# EAGLE design test board_2 (EAGLE 6.5.0)
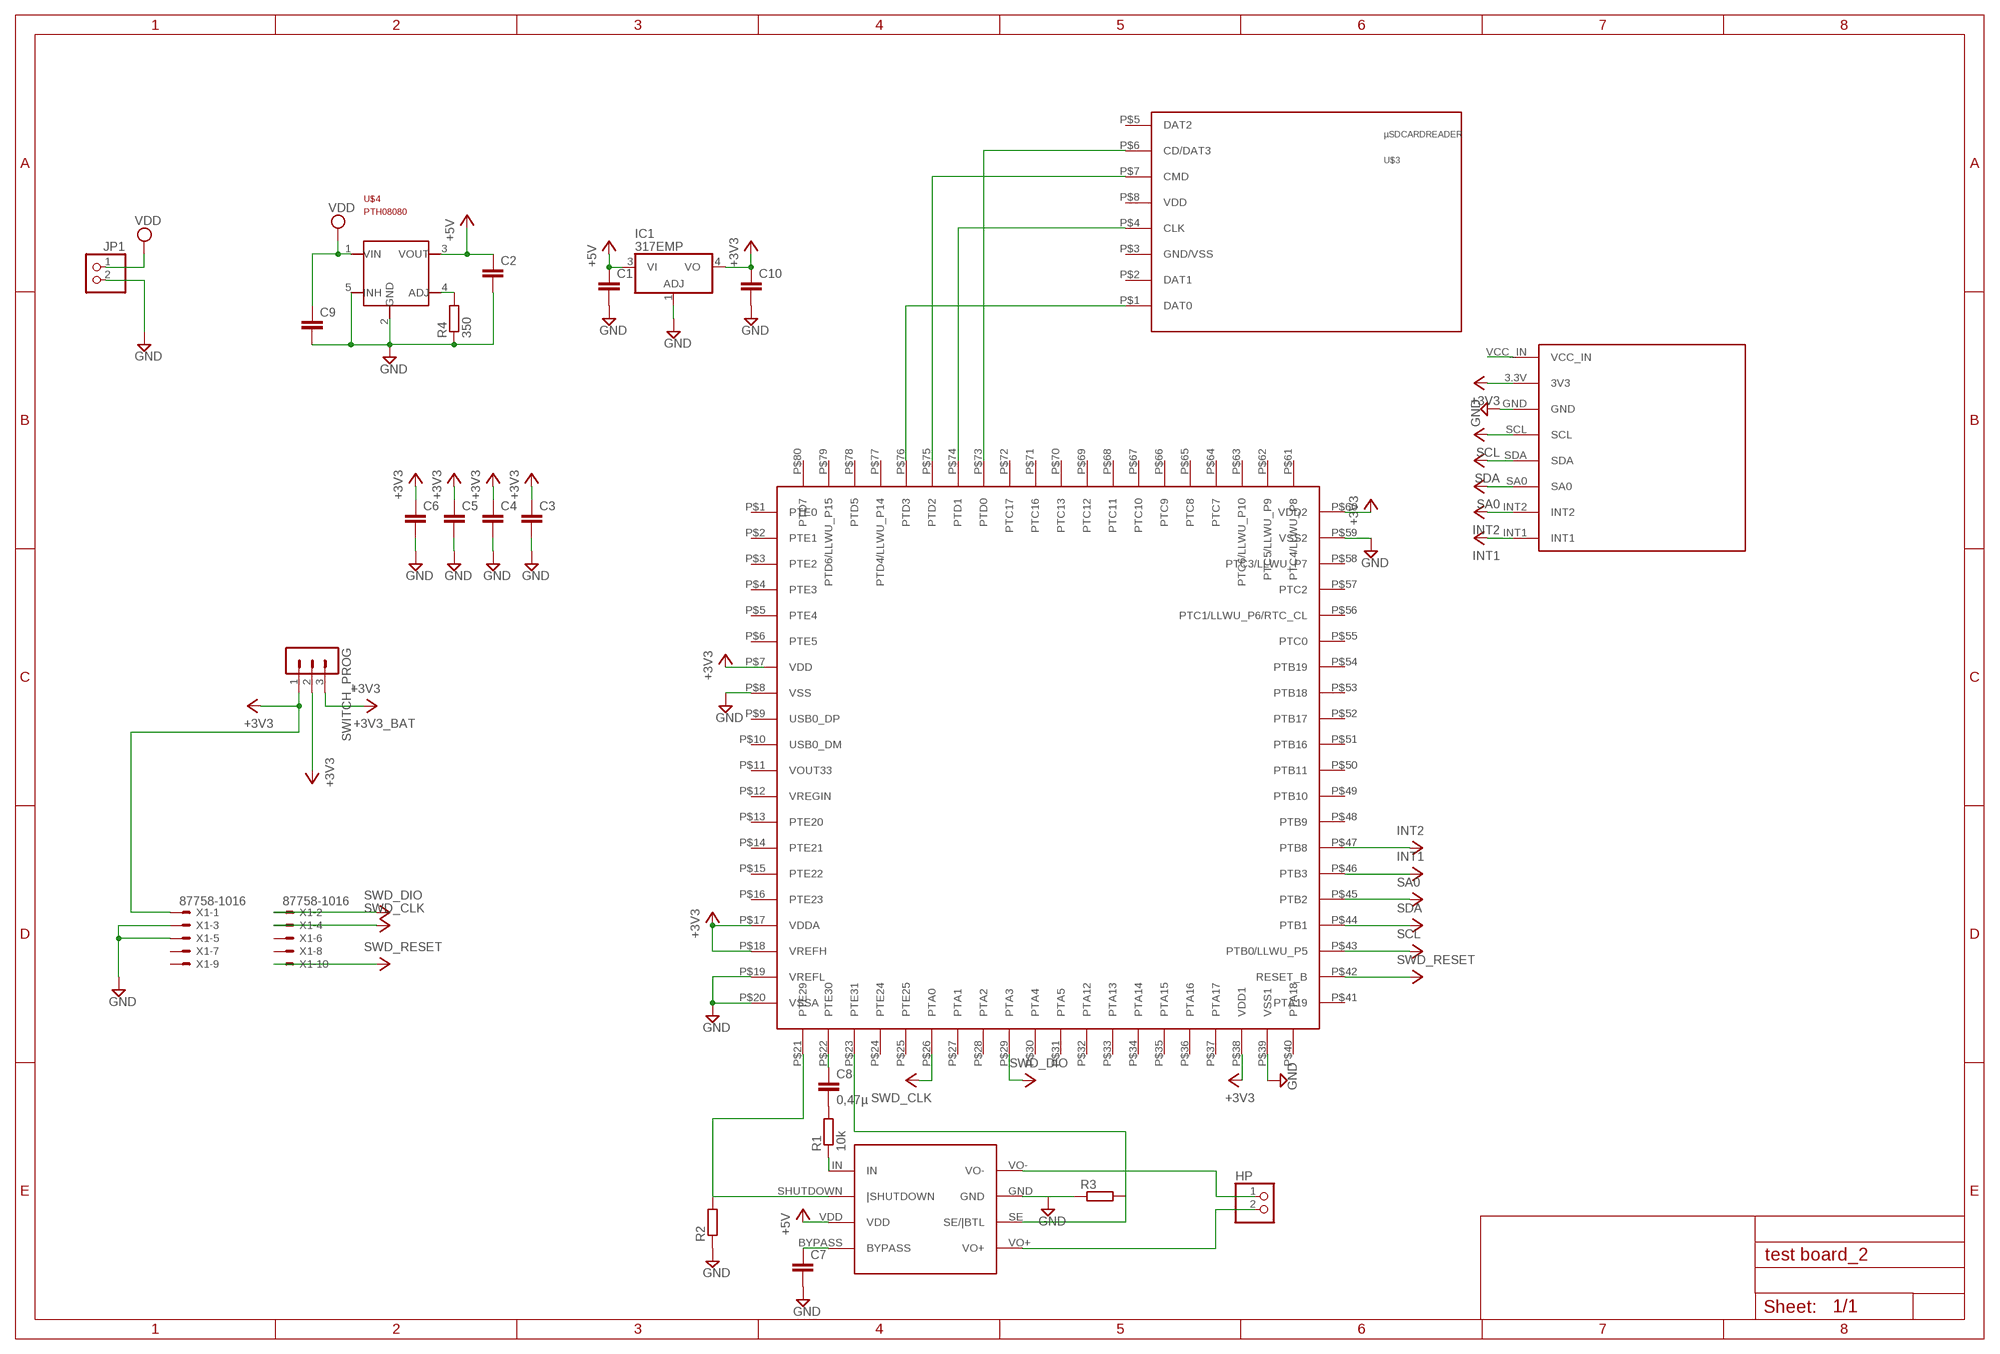
[diagram p0: schematic, sheet 1]

## Parts
C1  C-EUC1206K  [C1206K]
C2  C-EUC1206K  [C1206K]
C3  C-EUC1206K  [C1206K]
C4  C-EUC1206K  [C1206K]
C5  C-EUC1206K  [C1206K]
C6  C-EUC1206K  [C1206K]
C7  C-EU025-025X050  [C025-025X050]
C8  0,47µ  C-EUC1206K  [C1206K]
C9  C-EUC1206K  [C1206K]
C10  C-EUC1206K  [C1206K]
HP  PINHD-1X2  [1X02]
IC1  317EMP  [SOT223]
JP1  PINHD-1X2  [1X02]
R1  10k  R-EU_R0805  [R0805]
R2  R-EU_R0805  [R0805]
R3  R-EU_R0805  [R0805]
R4  350  R-EU_R0805  [R0805]
SWITCH_PROG  MA03-1  [MA03-1]
U$1  TPA0211  [TPA0211]
U$2  KL25Z_LQFP80  [KL25Z_LQFP80]
U$3  µSDCARDREADER  [MICROSD]
U$4  PTH08080  [PTH08080EUF]
U$5  DEV  [MMA8451]
X1  87758-1016  [87758-1016]

## Nets
+3V3: C3.1 C4.1 C5.1 C6.1 SWITCH_PROG.2 U$2.P$17(VDDA) U$2.P$18(VREFH) U$2.P$38(VDD1) U$2.P$60(VDD2) U$5.3.3V(3V3)
+3V3_BAT: C10.1 IC1.4(VO) SWITCH_PROG.3 ; supply symbol labelled +3V3
+3V3_SWD: SWITCH_PROG.1 X1.1 ; supply symbol labelled +3V3
+5V: C1.1 C2.1 IC1.3(VI) U$1.VDD U$4.3(VOUT)
GND [power]: C1.2 C2.2 C3.2 C4.2 C5.2 C6.2 C7.2 C9.2 C10.2 IC1.1(ADJ) JP1.2 R2.1 R3.1 R4.1 U$1.GND U$2.P$8(VSS) U$2.P$19(VREFL) U$2.P$20(VSSA) U$2.P$39(VSS1) U$2.P$59(VSS2) U$4.2(GND) U$4.5(INH) U$5.GND X1.3 X1.5
INT1: U$2.P$46(PTB3) U$5.INT1
INT2: U$2.P$47(PTB8) U$5.INT2
N$1: U$2.P$76(PTD3) U$3.P$1(DAT0)
N$2: U$2.P$73(PTD0) U$3.P$6(CD/DAT3)
N$3: U$2.P$75(PTD2) U$3.P$7(CMD)
N$4: U$2.P$74(PTD1) U$3.P$4(CLK)
N$5: C8.2 R1.2
N$6: C7.1 U$1.BYPASS
N$7: HP.1 U$1.VO-
N$9: U$5.VCC_IN
N$10: R1.1 U$1.IN
N$11: C8.1 U$2.P$22(PTE30)
N$12: R2.2 U$1.SHUTDOWN(|SHUTDOWN) U$2.P$21(PTE29)
N$14: R3.2 U$1.SE(SE/|BTL) U$2.P$23(PTE31)
N$18: R4.2 U$4.4(ADJ)
SA0: U$2.P$45(PTB2) U$5.SA0
SCL: U$2.P$43(PTB0/LLWU_P5) U$5.SCL
SDA: U$2.P$44(PTB1) U$5.SDA
SWD_CLK: U$2.P$26(PTA0) X1.4
SWD_DIO: U$2.P$29(PTA3) X1.2
SWD_RESET: U$2.P$42(RESET_B) X1.10
VDD: C9.1 JP1.1 U$4.1(VIN)
VO+: HP.2 U$1.VO+
Unconnected: U$2.P$1(PTE0) U$2.P$2(PTE1) U$2.P$3(PTE2) U$2.P$4(PTE3) U$2.P$5(PTE4) U$2.P$6(PTE5) U$2.P$7(VDD) U$2.P$9(USB0_DP) U$2.P$10(USB0_DM) U$2.P$11(VOUT33) U$2.P$12(VREGIN) U$2.P$13(PTE20) U$2.P$14(PTE21) U$2.P$15(PTE22) U$2.P$16(PTE23) U$2.P$24(PTE24) U$2.P$25(PTE25) U$2.P$27(PTA1) U$2.P$28(PTA2) U$2.P$30(PTA4) U$2.P$31(PTA5) U$2.P$32(PTA12) U$2.P$33(PTA13) U$2.P$34(PTA14) U$2.P$35(PTA15) U$2.P$36(PTA16) U$2.P$37(PTA17) U$2.P$40(PTA18) U$2.P$41(PTA19) U$2.P$48(PTB9) U$2.P$49(PTB10) U$2.P$50(PTB11) U$2.P$51(PTB16) U$2.P$52(PTB17) U$2.P$53(PTB18) U$2.P$54(PTB19) U$2.P$55(PTC0) U$2.P$56(PTC1/LLWU_P6/RTC_CL) U$2.P$57(PTC2) U$2.P$58(PTC3/LLWU_P7) U$2.P$61(PTC4/LLWU_P8) U$2.P$62(PTC5/LLWU_P9) U$2.P$63(PTC6/LLWU_P10) U$2.P$64(PTC7) U$2.P$65(PTC8) U$2.P$66(PTC9) U$2.P$67(PTC10) U$2.P$68(PTC11) U$2.P$69(PTC12) U$2.P$70(PTC13) U$2.P$71(PTC16) U$2.P$72(PTC17) U$2.P$77(PTD4/LLWU_P14) U$2.P$78(PTD5) U$2.P$79(PTD6/LLWU_P15) U$2.P$80(PTD7) U$3.P$2(DAT1) U$3.P$3(GND/VSS) U$3.P$5(DAT2) U$3.P$8(VDD) X1.6 X1.7 X1.8 X1.9

## Library data of the parts
C1-C10 = rcl:C-EU: CAPACITOR, European symbol
HP JP1 = pinhead:PINHD-1X2: PIN HEADER
IC1 = linear:*317: Positive VOLTAGE REGULATOR
R1-R4 = rcl:R-EU_: RESISTOR, European symbol
SWITCH_PROG = con-lstb:MA03-1: PIN HEADER; OC_FARNELL: unknown; OC_NEWARK: unknown
U$1 = TPA0211:TPA0211
U$2 = KL25Z_LQFP80:KL25Z_LQFP80: Freescale MCU 48MHz LQFP80
U$3 = Microsd:µSDCARDREADER
U$4 = PTH08080:PTH08080: DC-DC, Vin 5..18V, Vout 2..6V, 2A www.ti.com
U$5 = MMA8451_miniboard:DEV
X1 = con-molex:87758-1016: 10 Pin - 2mm Dual Row Single Wafer, Vertical T/H HDR Source: http://www.molex.com/pdm_docs/sd/877580616_sd.pdf; MF: MOLEX; MPN: 87758-1016; OC_FARNELL: 7472340; OC_NEWARK: 59J1558

## Net classes
1 power: width 0.508 mm

## Board
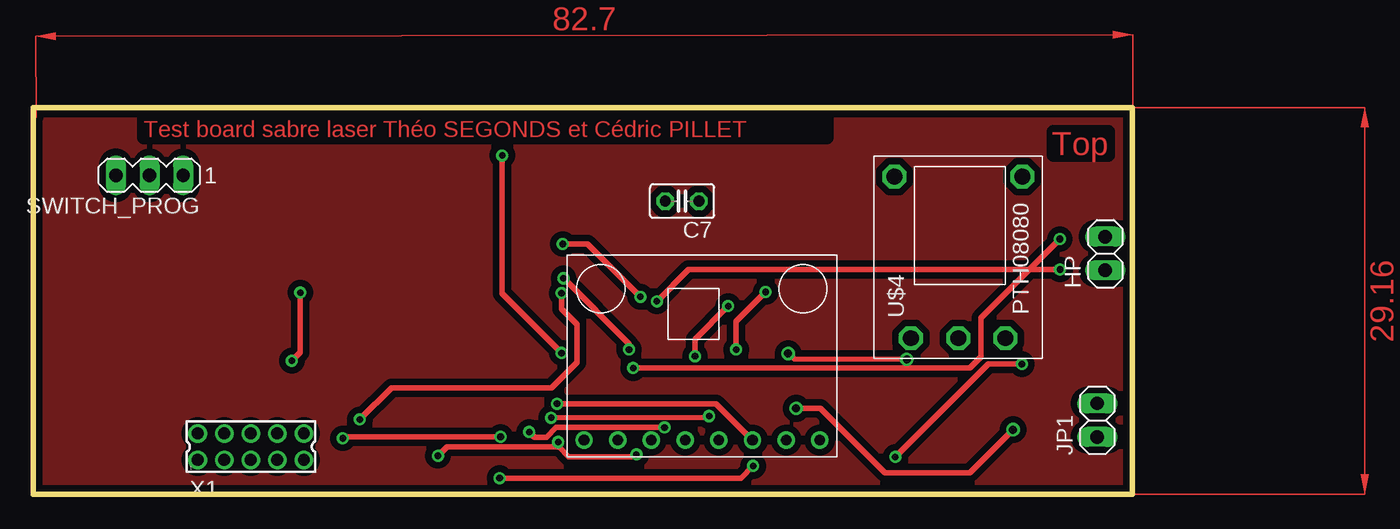
[diagram p1: board, top side]
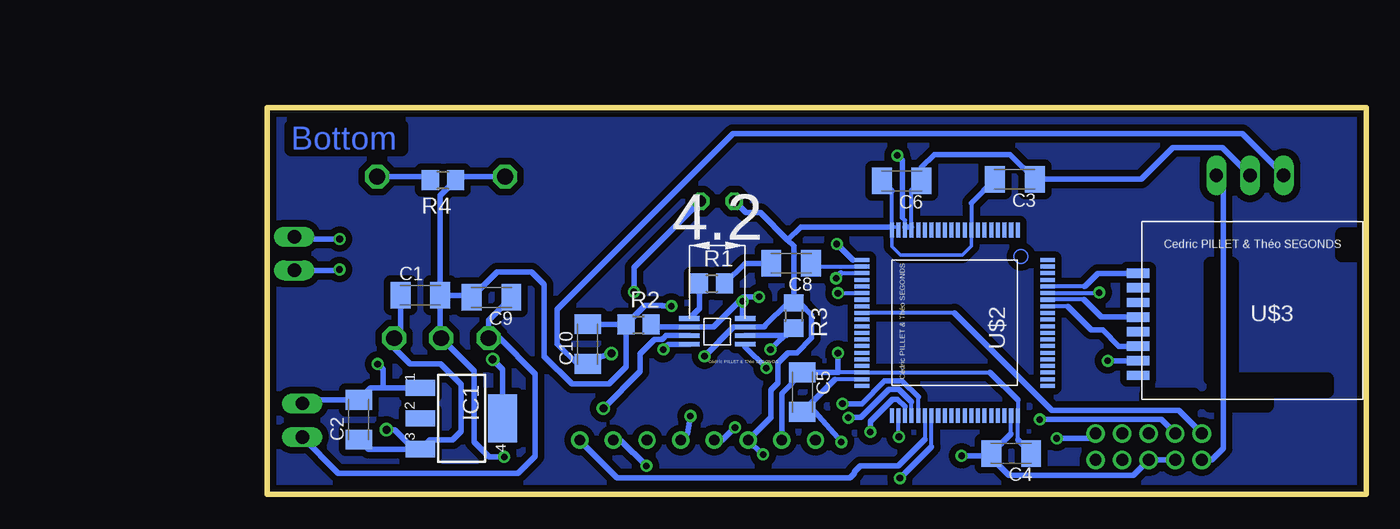
[diagram p2: board, bottom side, seen from below]

Size 82.86 x 29.16 mm. Coordinates in mm from the lower left corner, seen from the top.
Outline: 0,0 82.86,0 82.86,29.16 0,29.16 0,0
Copper layers (1*16): Top 0.1mm / dielectric 1.5mm / Bottom 0.1mm
Design rules "ensea *": minimum track width 0.5mm, minimum drill 0.5mm, track to track 0.5mm, track to pad 0.05mm, pad to pad 0.05mm, via to via 0.5mm, smd to smd 8mil, copper to edge 0.5mm, drill to drill 8mil, minimum pad ring 10mil, minimum via ring 8mil, stop-mask expansion 4mil, vias tented up to drill 0mil, thermal gap 10mil
tRestrict: area 38.5,36 to 50.4,47.8; area 63.4,35.4 to 66.1,38.5; area 15.5,49.1 to 19.4,50.8; area 15.4,59.9 to 19.4,61.4; area 0.6,45.7 to 3,64.7
bRestrict: area 56.5,45.8 to 57.8,48.2; area 46,55.1 to 48.6,57.8

### Footprints (pad centres in the part's own frame; a part is rotated, then mirrored left to right if it is on the bottom)
C1206K = smd 1.5 x 2: 1 -1.5,0; 2 1.5,0
C025-025X050 = drill 0.813 octagon: 1 -1.27,0; 2 1.27,0
1X02 = drill 1.016 long: 1 -1.27,0; 2 1.27,0
SOT223 = smd 1.219 x 2.235: 1 -2.311,-3.099; 2 0,-3.099; 3 2.311,-3.099 | smd 3.6 x 2.2: 4 0,3.099
R0805 = smd 1.3 x 1.5: 1 -0.95,0; 2 0.95,0
MA03-1 = drill 1.016 long: 1 -2.54,0; 2 0,0; 3 2.54,0
TPA0211 = smd 1.55 x 0.35: BYPASS -2.1,-1.15; GND 2.1,0.15; IN -2.1,0.8; SE 2.1,-0.5; SHUTDOWN -2.1,0.15; VDD -2.1,-0.5; VO+ 2.1,-1.15; VO- 2.1,0.8
KL25Z_LQFP80 = smd 0.61 x 0.305: P$1 -7.25,3.75; P$2 -7.25,3.25; P$3 -7.25,2.75; P$4 -7.25,2.25; P$5 -7.25,1.75; P$6 -7.25,1.25; P$7 -7.25,0.75; P$8 -7.25,0.25; P$9 -7.25,-0.25; P$10 -7.25,-0.75; P$11 -7.25,-1.25; P$12 -7.25,-1.75; P$13 -7.25,-2.25; P$14 -7.25,-2.75; P$15 -7.25,-3.25; P$16 -7.25,-3.75; P$17 -7.25,-4.25; P$18 -7.25,-4.75; P$19 -7.25,-5.25; P$20 -7.25,-5.75; P$41 7.25,-5.75; P$42 7.25,-5.25; P$43 7.25,-4.75; P$44 7.25,-4.25; P$45 7.25,-3.75; P$46 7.25,-3.25; P$47 7.25,-2.75; P$48 7.25,-2.25; P$49 7.25,-1.75; P$50 7.25,-1.25; P$51 7.25,-0.75; P$52 7.25,-0.25; P$53 7.25,0.25; P$54 7.25,0.75; P$55 7.25,1.25; P$56 7.25,1.75; P$57 7.25,2.25; P$58 7.25,2.75; P$59 7.25,3.25; P$60 7.25,3.75; P$121 6.75,3.75; P$122 6.75,3.25; P$123 6.75,2.75; P$124 6.75,2.25; P$125 6.75,1.75; P$126 6.75,1.25; P$127 6.75,0.75; P$128 6.75,0.25; P$129 6.75,-0.25; P$130 6.75,-0.75; P$131 6.75,-1.25; P$132 6.75,-1.75; P$133 6.75,-2.25; P$134 6.75,-2.75; P$135 6.75,-3.25; P$136 6.75,-3.75; P$137 6.75,-4.25; P$138 6.75,-4.75; P$139 6.75,-5.25; P$140 6.75,-5.75; P$141 -6.75,3.75; P$142 -6.75,3.25; P$143 -6.75,2.75; P$144 -6.75,2.25; P$145 -6.75,1.75; P$146 -6.75,1.25; P$147 -6.75,0.75; P$148 -6.75,0.25; P$149 -6.75,-0.25; P$150 -6.75,-0.75; P$151 -6.75,-1.25; P$152 -6.75,-1.75; P$153 -6.75,-2.25; P$154 -6.75,-2.75; P$155 -6.75,-3.25; P$156 -6.75,-3.75; P$157 -6.75,-4.25; P$158 -6.75,-4.75; P$159 -6.75,-5.25; P$160 -6.75,-5.75 | smd 0.305 x 0.61: P$21 -4.75,-8.25; P$22 -4.25,-8.25; P$23 -3.75,-8.25; P$24 -3.25,-8.25; P$25 -2.75,-8.25; P$26 -2.25,-8.25; P$27 -1.75,-8.25; P$28 -1.25,-8.25; P$29 -0.75,-8.25; P$30 -0.25,-8.25; P$31 0.25,-8.25; P$32 0.75,-8.25; P$33 1.25,-8.25; P$34 1.75,-8.25; P$35 2.25,-8.25; P$36 2.75,-8.25; P$37 3.25,-8.25; P$38 3.75,-8.25; P$39 4.25,-8.25; P$40 4.75,-8.25; P$61 4.75,6.25; P$62 4.25,6.25; P$63 3.75,6.25; P$64 3.25,6.25; P$65 2.75,6.25; P$66 2.25,6.25; P$67 1.75,6.25; P$68 1.25,6.25; P$69 0.75,6.25; P$70 0.25,6.25; P$71 -0.25,6.25; P$72 -0.75,6.25; P$73 -1.25,6.25; P$74 -1.75,6.25; P$75 -2.25,6.25; P$76 -2.75,6.25; P$77 -3.25,6.25; P$78 -3.75,6.25; P$79 -4.25,6.25; P$80 -4.75,6.25; P$81 -4.75,5.75; P$82 -4.25,5.75; P$83 -3.75,5.75; P$84 -3.25,5.75; P$85 -2.75,5.75; P$86 -2.25,5.75; P$87 -1.75,5.75; P$88 -1.25,5.75; P$89 -0.75,5.75; P$90 -0.25,5.75; P$91 0.25,5.75; P$92 0.75,5.75; P$93 1.25,5.75; P$94 1.75,5.75; P$95 2.25,5.75; P$96 2.75,5.75; P$97 3.25,5.75; P$98 3.75,5.75; P$99 4.25,5.75; P$100 4.75,5.75; P$101 -4.75,-7.75; P$102 -4.25,-7.75; P$103 -3.75,-7.75; P$104 -3.25,-7.75; P$105 -2.75,-7.75; P$106 -2.25,-7.75; P$107 -1.75,-7.75; P$108 -1.25,-7.75; P$109 -0.75,-7.75; P$110 -0.25,-7.75; P$111 0.25,-7.75; P$112 0.75,-7.75; P$113 1.25,-7.75; P$114 1.75,-7.75; P$115 2.25,-7.75; P$116 2.75,-7.75; P$117 3.25,-7.75; P$118 3.75,-7.75; P$119 4.25,-7.75; P$120 4.75,-7.75
MICROSD = smd 1.722 x 0.711: P$1 -0.4,0.4; P$2 -0.4,-0.7; P$3 -0.4,-1.8; P$4 -0.4,-2.9; P$5 -0.4,-4; P$6 -0.4,-5.1; P$7 -0.4,-6.2; P$8 -0.4,-7.3
PTH08080EUF = drill 1.2 octagon: 1 0,0; 2 0,-3.556; 3 0,-7.112; 4 12.192,-8.382; 5 12.192,1.27
MMA8451 = drill 0.8: 3.3V -7.62,6.35; GND -7.62,3.81; INT1 -7.62,-8.89; INT2 -7.62,-6.35; SA0 -7.62,-3.81; SCL -7.62,1.27; SDA -7.62,-1.27; VCC_IN -7.62,8.89
87758-1016 = drill 0.9 pad 1.27: 1 -4,-1; 2 -4,1; 3 -2,-1; 4 -2,1; 5 0,-1; 6 0,1; 7 2,-1; 8 2,1; 9 4,-1; 10 4,1

### Placement (x,y rotation side)
C1  71.32,15 0 bottom
C2  75.96,5.61 90 bottom
C3  26.5,23.74 180 bottom
C4  26.77,3.07 180 bottom
C5  42.52,7.69 270 bottom
C6  35.03,23.62 180 bottom
C7  48.92,22.1 180 top
C8  43.37,17.41 180 bottom
C9  65.96,14.84 180 bottom
C10  58.7,11.31 90 bottom
HP  80.83,18.14 90 top
IC1  68.21,5.7 270 bottom
JP1  80.23,5.57 90 top
R1  49.34,15.88 0 bottom
R2  54.87,12.78 0 bottom
R3  43.17,13.46 270 bottom
R4  69.62,23.67 180 bottom
SWITCH_PROG  8.77,24.05 180 top
U$1  48.93,12.45 0 bottom
U$2  30.03,12.91 270 bottom
U$3  16.81,16.25 0 bottom
U$4  66.19,11.76 90 top
U$5  50.42,11.68 90 top
X1  16.41,3.57 0 top

### Tracks (layer width: path | path; a pad name or v marks a point on that pad's centre or on a via)
+3V3  (via drill 0.5)
  Top 0.406: v35.36,25.54 35.36,15.12 v39.84,10.64
  Bottom 0.305: 39.8,9.16 U$2.P$38 28.38,9.16 | U$2.P$17 34.28,22.87 | 26.28,7.1 U$2.P$60 26.28,4.08 | U$2.P$18 34.78,20.64 34.98,20.84
  Bottom 0.406: 42.52,9.16 39.8,9.16 39.84,9.2 v39.84,10.64 | 42.52,9.16 C5.1 | 42.52,9.16 44.07,7.61 U$5.3.3V | U$2.P$17 U$2.P$18 | 34.28,22.87 C6.1 33.53,24.67 32.58,25.62 26.88,25.62 C3.1 16.98,23.74 14.58,26.14 10.86,26.14 SWITCH_PROG.2 | 28.38,9.16 26.28,7.1 | 34.98,20.84 34.98,25.16 v35.36,25.54 | C4.1 26.28,4.08
+3V3_BAT  (via drill 0.6)
  Top 0.406: v65.86,10.16 57.4,10.18 v56.92,10.6
  Bottom 0.406: SWITCH_PROG.3 9.36,27.18 47.74,27.18 61,13.92 61,11.34 59.47,9.81 C10.1 58.35,10.16 v56.92,10.6 | IC1.4 65.11,9.41 v65.86,10.16
+3V3_SWD
  Bottom 0.406: SWITCH_PROG.1 10.78,23.52 10.78,3.44 11.65,2.57 X1.1
+5V  (via drill 0.6)
  Top 0.406: v57.52,6.46 59.36,6.46 64.22,1.6 70.62,1.6 v73.88,4.86
  Bottom 0.406: 71.8,3.39 IC1.3 70.6,4.1 68.9,4.1 68.26,4.74 68.26,8.28 69.78,9.8 72.08,9.8 73.3,11.02 U$4.3 72.82,12.24 C1.1 | 71.8,3.39 75.24,3.39 C2.1 | U$1.VDD 52.79,11.95 53,11.74 53.02,11.74 53.1,11.66 53.66,11.66 54.74,10.58 54.74,9.24 v57.52,6.46 | v73.88,4.86 73.27,4.86 71.8,3.39
GND  (via drill 0.5)
  Top 0.406: v65,2.8 72,9.8 v74.54,9.8 | v49.9,10.4 49.9,11.68 v52.4,14.18 | v39.58,3.92 39.64,3.56 | 39.64,3.56 40.38,2.82 45.32,2.82 v45.48,2.98 | 39.64,3.56 31.2,3.56 v30.52,2.88
  Bottom 0.254: U$2.P$8 29.78,18.7 30.46,18.02 35.12,18.02 35.76,18.66 35.76,20.14 U$2.P$20 U$2.P$19
  Bottom 0.305: 29.78,21.96 U$2.P$8 | U$2.P$20 35.78,22.87 | 26.78,4.56 U$2.P$59 | U$2.P$39 40.05,8.66
  Bottom 0.406: R3.1 43.17,18.71 43.63,19.17 | 43.63,19.17 45.68,21.22 46.78,21.22 C7.2 | C3.2 29.78,21.96 | 35.78,22.87 C6.2 | X1.3 X1.5 17.56,1.42 26.94,1.42 28.27,2.75 C4.2 | C4.2 26.78,4.56 | 40.05,8.66 C5.2 41.57,6.19 v39.58,3.92 | 74.14,8.01 75.06,8.01 C2.2 79.96,7.11 JP1.2 | 74.14,8.01 IC1.1 | C1.2 69.82,11.83 U$4.2 67.26,9.27 67.26,3.94 66.12,2.8 v65,2.8 | C1.2 67.62,15 C9.2 65.54,16.76 62.92,16.76 61.98,15.82 61.98,10.4 59.9,8.32 57.1,8.32 55.82,9.6 R2.1 | C1.2 69.82,22.52 R4.1 68.39,23.95 U$4.5 | v74.54,9.8 74.14,9.4 74.14,8.01 | R2.1 55.85,12.81 C10.2 | R2.1 54.38,14.22 53.1,14.22 53.06,14.18 v52.4,14.18 | R3.1 43.61,14.41 45.32,12.7 45.32,12.68 45.4,12.6 U$1.GND 47.7,12.6 v49.9,10.4 | R3.1 42.71,14.41 41.82,13.52 41.82,11.76 42.94,10.64 43.6,10.64 44.34,9.9 44.34,8.38 44.88,7.84 44.88,5.79 U$5.GND 45.53,2.98 v45.48,2.98 | U$2.P$20 42.64,20.16 43.63,19.17 | v30.52,2.88 28.46,2.88 C4.2
INT1
  Bottom 0.305: U$2.P$46 33.28,4.12
  Bottom 0.406: 33.28,4.12 35.28,2.12 38.14,2.12 38.6,1.66 38.6,1.58 38.94,1.24 56.49,1.24 U$5.INT1
INT2  (via drill 0.5)
  Top 0.406: v54.28,2.12 53.36,1.2 v35.16,1.2
  Bottom 0.305: 32.78,3.58 U$2.P$47
  Bottom 0.406: U$5.INT2 56.22,4.06 v54.28,2.12 | v35.16,1.2 32.78,3.58
N$1
  Bottom 0.305: 21.26,15.66 U$2.P$76
  Bottom 0.406: U$3.P$1 20.23,16.65 21.18,15.7 21.22,15.7 21.26,15.66
N$2
  Bottom 0.305: 22.5,14.16 U$2.P$73
  Bottom 0.406: U$3.P$6 18.65,11.15 19.88,12.38 20.72,12.38 22.5,14.16
N$3  (via drill 0.5)
  Top 0.406: v20.14,15.2 20.14,10.7 v19.5,10.06
  Bottom 0.305: U$2.P$75 20.18,15.16
  Bottom 0.406: 20.18,15.16 v20.14,15.2 | v19.5,10.06 U$3.P$7
N$4
  Bottom 0.305: 21.3,14.66 U$2.P$74
  Bottom 0.406: U$3.P$4 19.99,13.35 21.3,14.66
N$5
  Bottom 0.406: C8.2 46.86,17.41 R1.2
N$6  (via drill 0.5)
  Top 0.406: v53,10.9 53,13.02 v55.22,15.24
  Bottom 0.406: U$1.BYPASS 52.6,11.3 v53,10.9 | v55.22,15.24 55.22,17.07 C7.1
N$7  (via drill 0.5)
  Top 0.406: v77.42,16.94 49.42,16.94 v47.02,14.54
  Bottom 0.406: HP.1 77.49,16.87 v77.42,16.94 | v47.02,14.54 47.02,13.44 U$1.VO-
N$10
  Bottom 0.406: R1.1 50.29,13.99 U$1.IN
N$11
  Bottom 0.305: 41.87,17.16 U$2.P$22
  Bottom 0.406: C8.1 41.87,17.16
N$12  (via drill 0.5)
  Top 0.406: v45.78,14.88 41.8,18.86 v39.92,18.86
  Bottom 0.305: 38.72,17.66 U$2.P$21
  Bottom 0.406: R2.2 53.74,12.6 U$1.SHUTDOWN 49.22,12.6 46.94,14.88 v45.78,14.88 | v39.92,18.86 38.72,17.66
N$14  (via drill 0.5)
  Top 0.406: v44.92,10.9 44.92,11.34 v39.98,16.28
  Bottom 0.305: 39.6,16.66 U$2.P$23
  Bottom 0.406: U$1.SE 43.73,11.95 R3.2 43.31,12.51 v44.92,10.9 | v39.98,16.28 39.6,16.66
N$18
  Bottom 0.406: R4.2 70.85,23.95 U$4.4
N$25
  pour Bottom (isolate 0.5): 0.58,28.66 82.82,28.56 82.64,0.42 0.4,0.52
N$26
  pour Top (isolate 0.5): 82.58,28.3 82.76,0.52 0.4,0.52 0.22,28.4
SA0  (via drill 0.5)
  Top 0.406: v39.5,6.82 51.47,6.82 U$5.SA0
  Bottom 0.305: U$2.P$45 33.78,7.32
  Bottom 0.406: 33.78,7.32 35,8.54 36.32,8.54 38.04,6.82 v39.5,6.82
SCL  (via drill 0.5)
  Top 0.406: v47.6,5.02 39.44,5.02 38.7,4.28 37.8,4.28 v37.4,4.68
  Bottom 0.305: 34.78,6.6 U$2.P$43
  Bottom 0.406: U$5.SCL 48.56,4.06 v47.6,5.02 | v37.4,4.68 37.4,5.5 35.74,7.16 35.34,7.16 34.78,6.6
SDA  (via drill 0.5)
  Top 0.406: v39.06,5.76 50.88,5.8 v50.96,5.88
  Bottom 0.305: U$2.P$44 34.28,6.94
  Bottom 0.406: 34.28,6.94 35.22,7.88 36,7.88 38.1,5.78 38.84,5.78 v39.06,5.76 | v50.96,5.88 51.16,4.59 U$5.SDA
SWD_CLK  (via drill 0.5)
  Top 0.406: v24.62,5.62 27.02,8.02 39.1,8.02 41,9.92 41,12.8 39.84,13.96 v39.84,15.16
  Bottom 0.305: v39.84,15.16 U$2.P$26
  Bottom 0.406: X1.4 15.46,5.62 v24.62,5.62
SWD_DIO
  Bottom 0.305: 31.06,13.66 U$2.P$29
  Bottom 0.406: X1.2 14.14,6.3 23.7,6.3 31.06,13.66
SWD_RESET  (via drill 0.5)
  Top 0.406: v23.34,4.2 23.46,4.32 v35.24,4.32
  Bottom 0.305: 35.28,4.36 U$2.P$42
  Bottom 0.406: X1.10 20.78,4.2 v23.34,4.2 | v35.24,4.32 35.28,4.36
VDD
  Bottom 0.406: JP1.1 77.51,1.58 63.94,1.58 62.66,2.86 62.66,9.08 65.34,11.76 U$4.1 66.19,13.11 C9.1
VO+  (via drill 0.5)
  Top 0.406: v77.4,19.24 71.46,13.3 71.46,10.34 70.62,9.5 v45.24,9.5
  Bottom 0.406: HP.2 80.66,19.24 v77.4,19.24 | v45.24,9.5 46.83,11.09 U$1.VO+
(copper drawn outside any net)
  shapes: Top area x2

### Text on the board
Top: Test board sabre laser Théo SEGONDS et Cédric PILLET | Top
Bottom: Bottom